# Altium schematic sheet dsp.SchDoc
size 420 x 297 mm; Address1: Address1; Address2: Address2; Address3: Address3; Address4: Address4; DocumentNumber: АБВГ.123456.001 Э3; SheetNumber: 2; SheetTotal: 2; Scale: 1:1; DocumentType: Схема электрическая принципиальная; FirstReferrence: АБВГ.123456.001
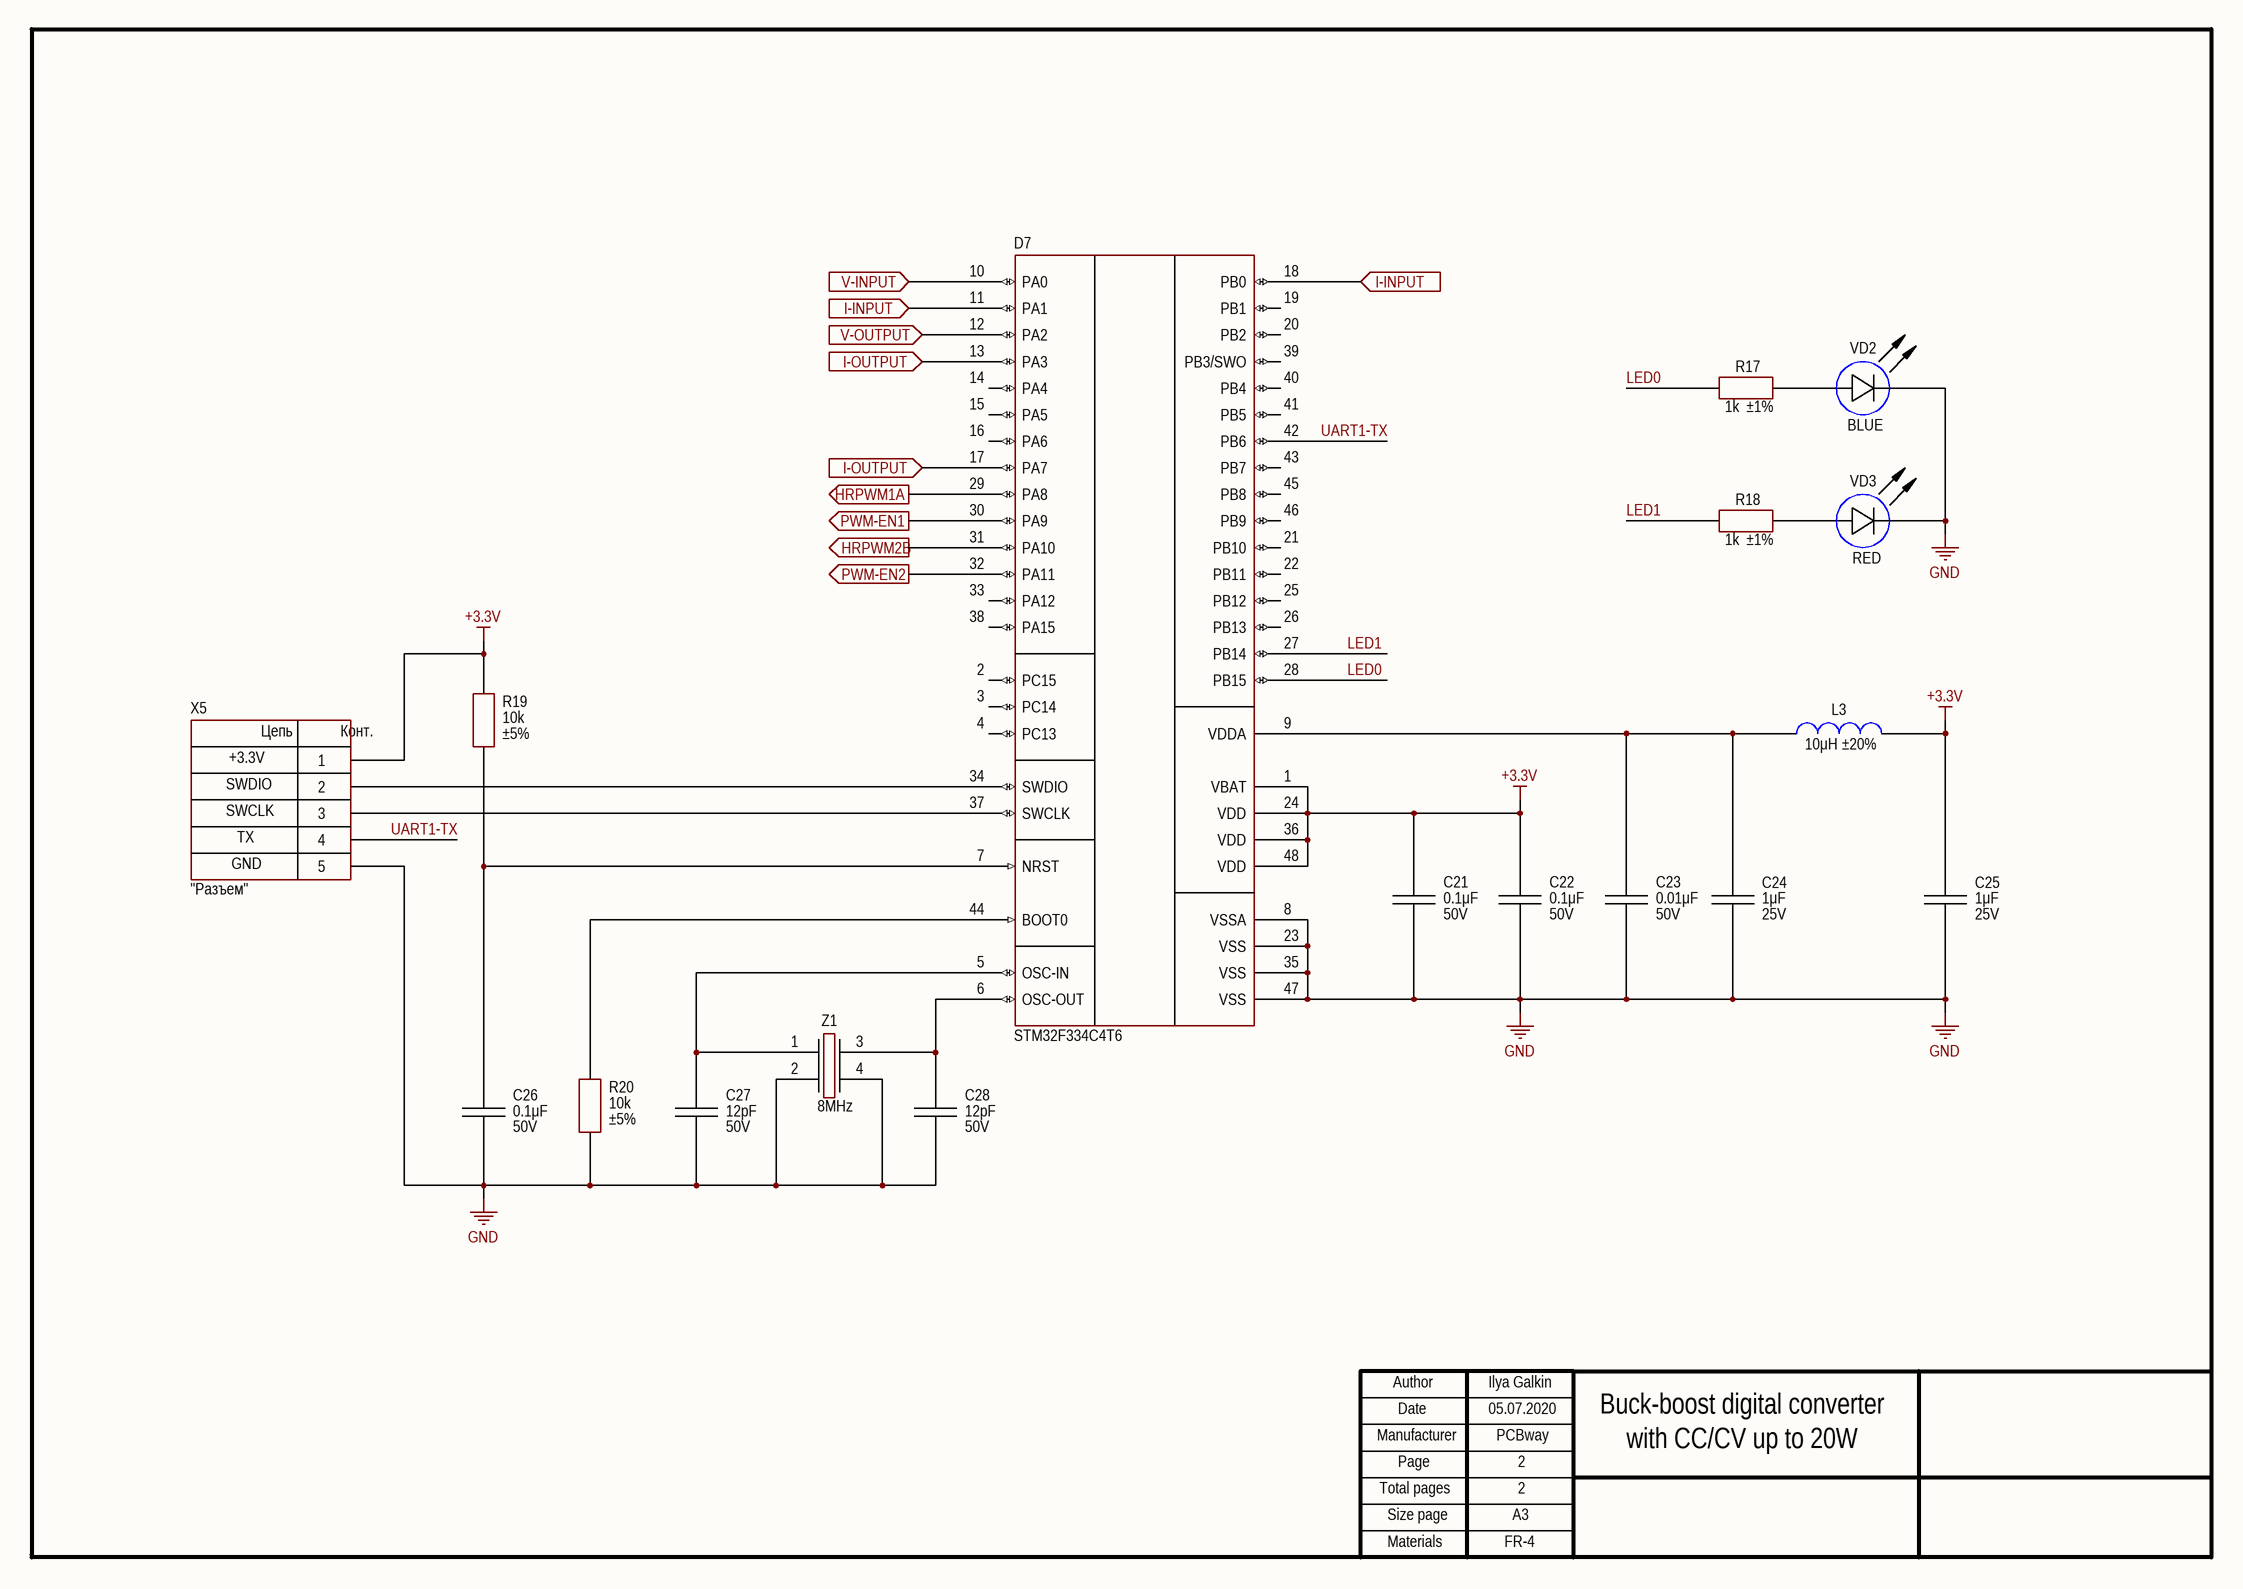
[diagram p0: dsp.SchDoc]

## Parts
C21  value 0.1μF  Voltage: 50V  [CAP: 0603]
C22  value 0.1μF  Voltage: 50V  [CAP: 0603]
C23  value 0.01μF  Voltage: 50V  [CAP: 0603]
C24  value 1μF  Voltage: 25V  [CAP: 0603]
C25  value 1μF  Voltage: 25V  [CAP: 0603]
C26  value 0.1μF  Voltage: 50V  [CAP: 0603]
C27  value 12pF  Voltage: 50V  [CAP: 0603]
C28  value 12pF  Voltage: 50V  [CAP: 0603]
D7  (no value)  [48-LQFP]
L3  value 10μH  Tolerance: ±20%  [IND: 0603]
R17  value 1k  Tolerance: ±1%  [RES: 0603]
R18  value 1k  Tolerance: ±1%  [RES: 0603]
R19  value 10k  Tolerance: ±5%  [RES: 0603]
R20  value 10k  Tolerance: ±5%  [RES: 0603]
VD2  Color: BLUE  [LED: 0603B]
VD3  Color: RED  [LED: 0603R]
X5  CommentText: "Разъем"  [CON: SM05B-GHS]
Z1  Frequency: 8MHz  [OSC: 3225]

## Ports
HRPWM1A (out), HRPWM2B (out), I-INPUT (in), I-OUTPUT (in), PWM-EN1 (out), PWM-EN2 (out), V-INPUT (in), V-OUTPUT (in)

## Nets
+3.3V: C21.2 C22.2 C25.2 D7.1(VBAT) D7.24(VDD) D7.36(VDD) D7.48(VDD) L3.1 R19.2 X5.1
GND: C21.1 C22.1 C23.1 C24.1 C25.1 C26.1 C27.1 C28.1 D7.8(VSSA) D7.23(VSS) D7.35(VSS) D7.47(VSS) R20.1 VD2.2(C) VD3.2(C) X5.5 Z1.2 Z1.4
HRPWM1A: D7.29(PA8) ; port HRPWM1A
HRPWM2B: D7.31(PA10) ; port HRPWM2B
I-INPUT: D7.11(PA1) D7.18(PB0) ; port I-INPUT
I-OUTPUT: D7.13(PA3) D7.17(PA7) ; port I-OUTPUT
LED0: D7.28(PB15) R17.2
LED1: D7.27(PB14) R18.2
PWM-EN1: D7.30(PA9) ; port PWM-EN1
PWM-EN2: D7.32(PA11) ; port PWM-EN2
UART1-TX: D7.42(PB6) X5.4
V-INPUT: D7.10(PA0) ; port V-INPUT
V-OUTPUT: D7.12(PA2) ; port V-OUTPUT
NetC23_2: C23.2 C24.2 D7.9(VDDA) L3.2
NetC26_2: C26.2 D7.7(NRST) R19.1
NetC27_2: C27.2 D7.5(OSC-IN) Z1.1
NetC28_2: C28.2 D7.6(OSC-OUT) Z1.3
NetD7_34: D7.34(SWDIO) X5.2
NetD7_37: D7.37(SWCLK) X5.3
NetD7_44: D7.44(BOOT0) R20.2
NetR17_1: R17.1 VD2.1(A)
NetR18_1: R18.1 VD3.1(A)

Not connected (* = marked no-connect by the designer): D7 2(PC15) 3(PC14) 4(PC13) 14(PA4) 15(PA5) 16(PA6) 19(PB1) 20(PB2) 21(PB10) 22(PB11) 25(PB12) 26(PB13) 33(PA12) 38(PA15) 39(PB3/SWO) 40(PB4) 41(PB5) 43(PB7) 45(PB8) 46(PB9)

## Notes on the sheet
- SWDIO
- +3.3V
- SWCLK
- GND
- TX
- Ilya Galkin
- 05.07.2020
- PCBway
- 2
- Buck-boost digital converter
- with CC/CV up to 20W
- FR-4
- Author
- Manufacturer
- Date
- Page
- Total pages
- Size page
- A3
- Materials
- (in symbol Connector_SM05B) Цепь; Конт.

## Library data of the parts
C21 C22 C26 = Ceramic_0603: Manufacturer: Yageo; PartNumber: CL10B104KB8WPND; ValueManufacturerPartNumber: Ceramic capacitor, 0.1μF, X7R, ±10%, 50V, 0603, -55...+125°C; TypeCapacitor: Ceramic capacitor; Tolerance: ±10%; TypeDielectric: X7R; Package: 0603; HelpURL: https://www.digikey.com/product-detail/en/samsung-electro-mechanics/CL10B104KB8WPND/1276-CL10B104KB8WPNDCT-ND/11488014; Temperature: -55...+125°C
C23 = Ceramic_0603: Manufacturer: Yageo; PartNumber: CL10B103KB8NNNC; ValueManufacturerPartNumber: Ceramic capacitor, 0.01μF, X7R, ±10%, 50V, 0603, -55...+125°C; TypeCapacitor: Ceramic capacitor; Tolerance: ±10%; TypeDielectric: X7R; Package: 0603; HelpURL: https://www.digikey.com/product-detail/en/samsung-electro-mechanics/CL10B103KB8NNNC/1276-1009-1-ND/3889095; Temperature: -55...+125°C
C24 C25 = Ceramic_0603: Manufacturer: Samsung; PartNumber: CL10B105KA8NNNC; ValueManufacturerPartNumber: Ceramic capacitor, 1μF, X7R, ±10%, 25V, 0603, -55...+125°C; TypeCapacitor: Ceramic capacitor; Tolerance: ±10%; TypeDielectric: X7R; Package: 0603; HelpURL: https://www.digikey.com/product-detail/en/samsung-electro-mechanics/CL10B105KA8NNNC/1276-1184-1-ND/3889270; Temperature: -55...+125°C
C27 C28 = Ceramic_0603: Manufacturer: Samsung; PartNumber: CL10C120JB8NNNC; ValueManufacturerPartNumber: Ceramic capacitor, 12pF, NPO, ±10%, 50V, 0603, -55...+125°C; TypeCapacitor: Ceramic capacitor; Tolerance: ±10%; TypeDielectric: NPO; Package: 0603; HelpURL: https://www.digikey.com/product-detail/en/samsung-electro-mechanics/CL10C120JB8NNNC/1276-1254-1-ND/3889340; Temperature: -55...+125°C
D7 = STM32F334C4T6: Cortex-M4; Manufacturer: STMicroelectronics; ValueManufacturerPartNumber: IC microcontroller, 32-Bit, Cortex-M4, 72MHz, 16KB, 12KB, 2...3.6V, -40...+85°C, 48-LQFP; Supply: 2...3.6V; Speed: 72MHz; CoreSize: 32-Bit; MemoryROM: 16KB; MemoryRAM: 12KB; HelpURL: https://www.digikey.com/products/en?keywords=STM32F334C4T6; Package: 48-LQFP; ComponentType: IC microcontroller; Temperature: -40...+85°C; CoreProcessor: Cortex-M4; PartNumber: STM32F334C4T6
L3 = Inductor_0603: Manufacturer: Murata Electronics; PartNumber: LQM18FN100M00D; ValueManufacturerPartNumber: Fixed inductor, 10μH, ±20%, 0603, 50mA, -55...+125°C; TypeInductor: Fixed inductor; MaxCurrent: 50mA; Package: 0603; HelpURL: https://www.digikey.com/product-detail/en/murata-electronics-north-america/LQM18FN100M00D/490-4025-1-ND/1016285; Temperature: -55...+125°C
R17 R18 = Resistor_0603: Manufacturer: Yageo; PartNumber: RC0603FR-071KL; ValueManufacturerPartNumber: Resistor film, 1k, ±1%, 0603, 0.1W, -55...+125°C; TypeResistor: Resistor film; Power: 0.1W; Package: 0603; HelpURL: https://www.digikey.com/product-detail/en/yageo/RC0603FR-071KL/311-1-00KHRCT-ND/729790; Temperature: -55...+125°C
R19 R20 = Resistor_0603: Manufacturer: Yageo; PartNumber: RC0603JR-0710KL; ValueManufacturerPartNumber: Resistor film, 10k, ±5%, 0603, 0.1W, -55...+125°C; TypeResistor: Resistor film; Power: 0.1W; Package: 0603; HelpURL: https://www.digikey.com/product-detail/en/yageo/RC0603JR-0710KL/311-10KGRCT-ND/729647; Temperature: -55...+125°C
VD2 = LED_single: Manufacturer: Wurth; ValueManufacturerPartNumber: LED, 20mA, 3.2V, 0603, -55...+150°C; PartNumber: 150060BS75000; TypeDiode: LED; Current: 20mA; VoltageDrop: 3.2V; Package: 0603; HelpURL: https://www.digikey.com/product-detail/en/w-rth-elektronik/150060BS75000/732-4966-1-ND/4489893; Temperature: -55...+150°C
VD3 = LED_single: Manufacturer: Wurth; ValueManufacturerPartNumber: LED, 20 mA, 2V, 0603, -55...+150°C; PartNumber: 150060RS75000; TypeDiode: LED; Current: 20 mA; VoltageDrop: 2V; Package: 0603; HelpURL: https://www.digikey.com/product-detail/en/w-rth-elektronik/150060RS75000/732-4978-1-ND/4489899; Temperature: -55...+150°C
X5 = Connector_SM05B: Manufacturer: JST; ValueManufacturerPartNumber: Connector, 5pin, 1.25mm, 50VDC, 1A; PartNumber: SM05B-GHS; VoltageMax: 50VDC; Pitch: 1.25mm; CurrentMax: 1A; Multichannel: 5pin; HelpURL: https://www.digikey.com/product-detail/en/jst-sales-america-inc/SM05B-GHS-TB-LF-SN/455-1567-1-ND/807835; TypeConnector: Connector
Z1 = Crystal_3225: Manufacturer: ECS; PartNumber: ECS-80-12-33-JGN-TR; ValueManufacturerPartNumber: Crystal, 8MHz, 12pF, ±30ppm, case 3225, -40...+85°C; LoadCapacitance: 12pF; Tolerance: ±30ppm; Package: case 3225; HelpURL: https://www.digikey.com/product-detail/en/ecs-inc/ECS-80-12-33-JGN-TR/50-ECS-80-12-33-JGN-CT-ND/10478769; Temperature: -40...+85°C; TypeOscilator: Crystal